# EAGLE design Drehzahlanzeige_RevA (EAGLE 7.6.0)

## Sheet 1 of 2
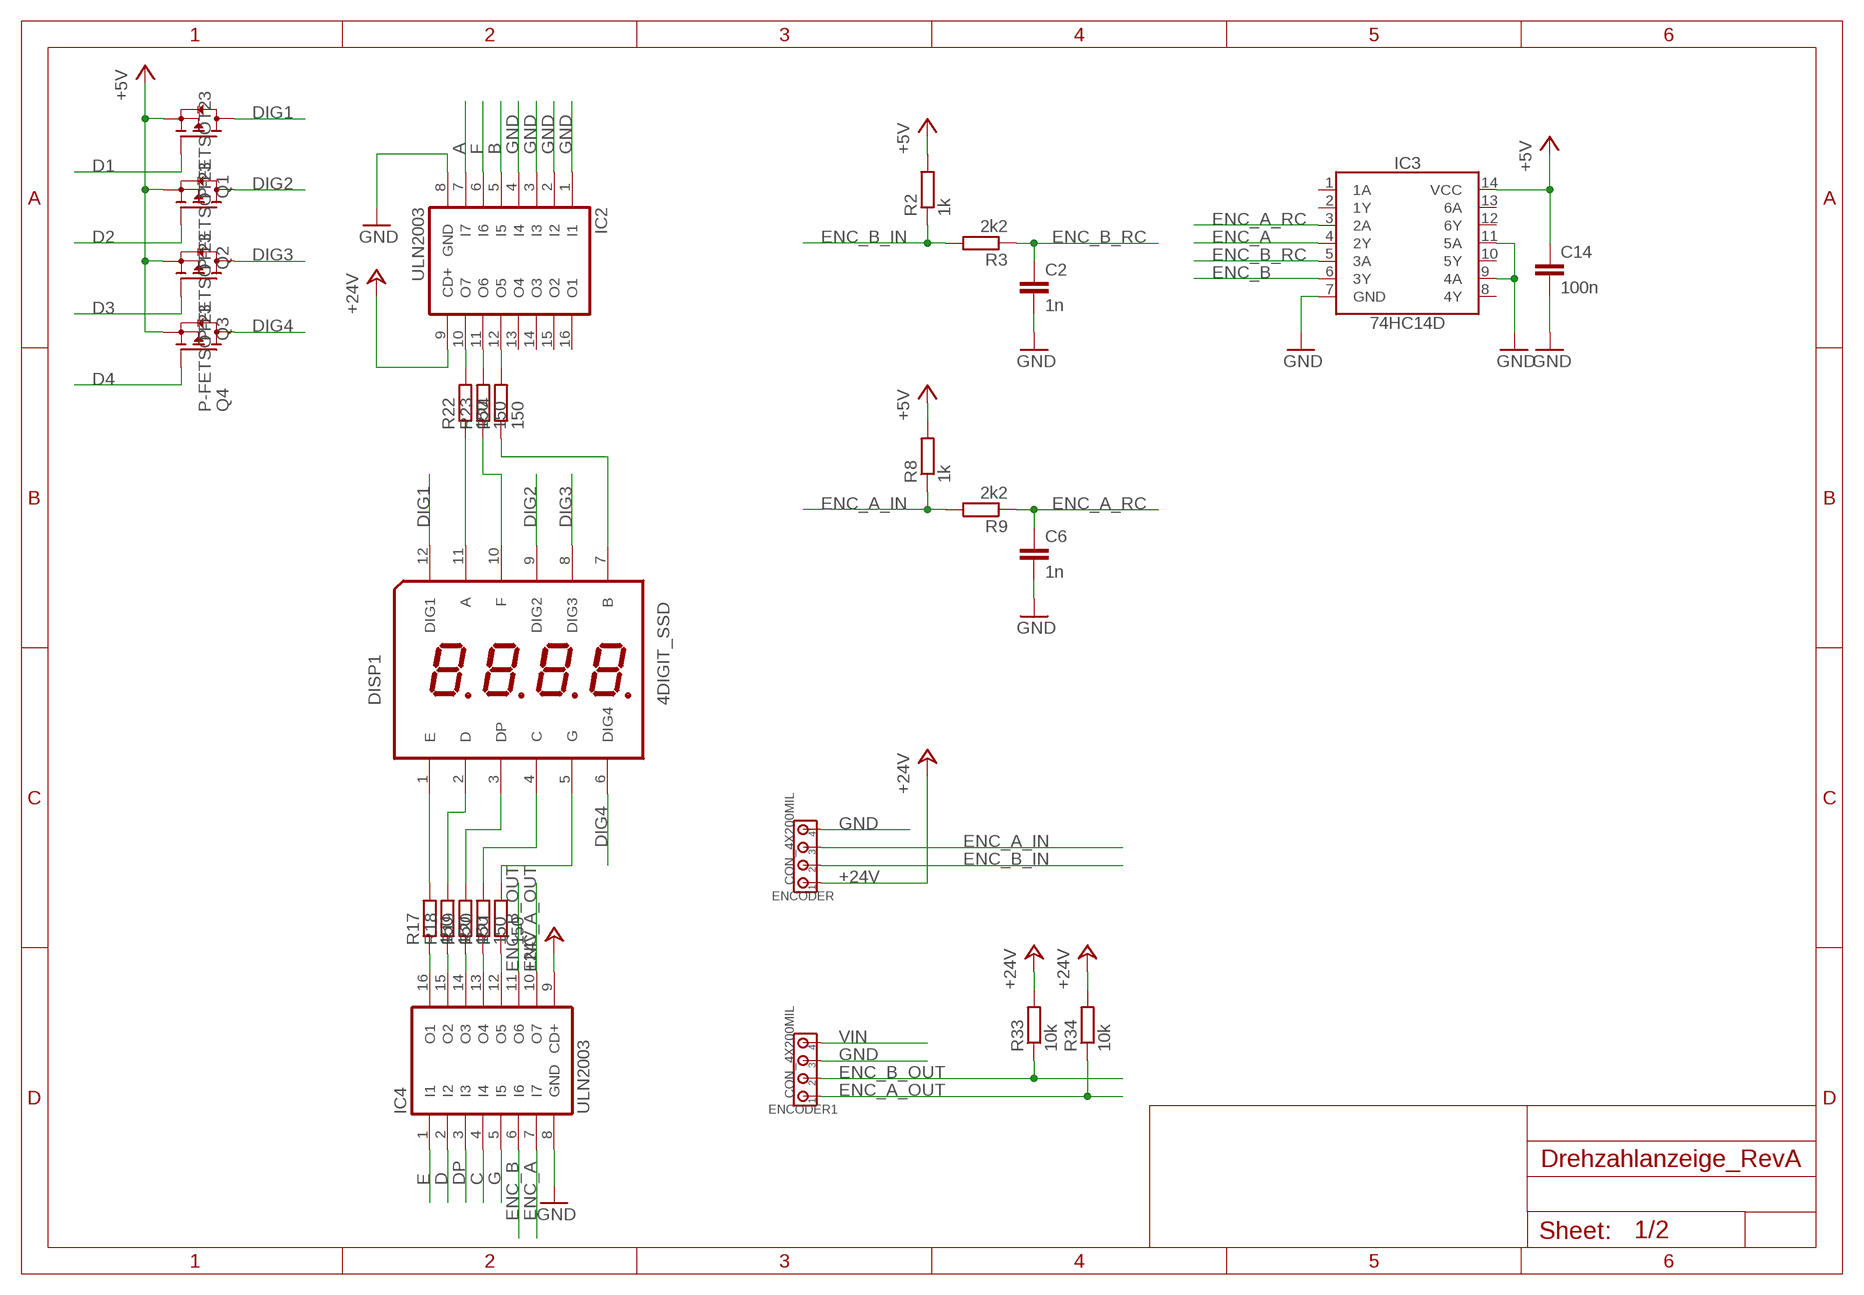
[diagram p0: schematic, sheet 1]

### Parts
C2  1n  CC0805  [C0805]
C6  1n  CC0805  [C0805]
C14  100n  CC0805  [C0805]
DISP1  4DIGIT_SSD  [4DIGIT_SSD]
ENCODER  CON_4X200MIL  [200MIL_4X]
ENCODER1  CON_4X200MIL  [200MIL_4X]
IC2  ULN2003  [SO16]
IC3  74HC14D  [SO14]
IC4  ULN2003  [SO16]
Q1  P-FETSOT23  [SOT23]
Q2  P-FETSOT23  [SOT23]
Q3  P-FETSOT23  [SOT23]
Q4  P-FETSOT23  [SOT23]
R2  1k  RESISTORR0805  [R0805]
R3  2k2  RESISTORR0805  [R0805]
R8  1k  RESISTORR0805  [R0805]
R9  2k2  RESISTORR0805  [R0805]
R17  150  RESISTORR0805  [R0805]
R18  150  RESISTORR0805  [R0805]
R19  150  RESISTORR0805  [R0805]
R20  150  RESISTORR0805  [R0805]
R21  150  RESISTORR0805  [R0805]
R22  150  RESISTORR0805  [R0805]
R23  150  RESISTORR0805  [R0805]
R24  150  RESISTORR0805  [R0805]
R33  10k  RESISTORR0805  [R0805]
R34  10k  RESISTORR0805  [R0805]

### Nets
+5V [+5v]: C14.1 IC3.14(VCC) Q1.2(S) Q2.2(S) Q3.2(S) Q4.2(S) R2.2 R8.2 ; also sheet 2
+24V [+5v]: ENCODER.1 IC2.9(CD+) IC4.9(CD+) R33.2 R34.2 ; also sheet 2
A: IC2.7(I7) ; also sheet 2
B: IC2.5(I5) ; also sheet 2
C: IC4.4(I4) ; also sheet 2
D: IC4.2(I2) ; also sheet 2
D1: Q1.1(G) ; also sheet 2
D2: Q2.1(G) ; also sheet 2
D3: Q3.1(G) ; also sheet 2
D4: Q4.1(G) ; also sheet 2
DIG1: DISP1.12(DIG1) Q1.3(D)
DIG2: DISP1.9(DIG2) Q2.3(D)
DIG3: DISP1.8(DIG3) Q3.3(D)
DIG4: DISP1.6(DIG4) Q4.3(D)
DP: IC4.3(I3) ; also sheet 2
E: IC4.1(I1) ; also sheet 2
ENC_A: IC3.4(2Y) IC4.7(I7) ; also sheet 2
ENC_A_IN: ENCODER.3 R8.1 R9.2
ENC_A_OUT: ENCODER1.1 IC4.10(O7) R34.1
ENC_A_RC: C6.1 IC3.3(2A) R9.1
ENC_B: IC3.6(3Y) IC4.6(I6) ; also sheet 2
ENC_B_IN: ENCODER.2 R2.1 R3.2
ENC_B_OUT: ENCODER1.2 IC4.11(O6) R33.1
ENC_B_RC: C2.1 IC3.5(3A) R3.1
F: IC2.6(I6) ; also sheet 2
G: IC4.5(I5) ; also sheet 2
GND: C2.2 C6.2 C14.2 ENCODER1.3 ENCODER.4 IC2.1(I1) IC2.2(I2) IC2.3(I3) IC2.4(I4) IC2.8(GND) IC3.7(GND) IC3.9(4A) IC3.11(5A) IC4.8(GND) ; also sheet 2
N$5: DISP1.1(E) R17.2
N$6: DISP1.2(D) R18.2
N$10: DISP1.3(DP) R19.2
N$11: DISP1.4(C) R20.2
N$12: DISP1.5(G) R21.2
N$13: DISP1.11(A) R22.1
N$14: DISP1.10(F) R23.1
N$15: DISP1.7(B) R24.1
N$16: IC4.16(O1) R17.1
N$17: IC4.15(O2) R18.1
N$18: IC4.14(O3) R19.1
N$19: IC4.13(O4) R20.1
N$20: IC4.12(O5) R21.1
N$21: IC2.10(O7) R22.2
N$22: IC2.11(O6) R23.2
N$23: IC2.12(O5) R24.2
VIN: ENCODER1.4 ; also sheet 2
Unconnected: IC2.13(O4) IC2.14(O3) IC2.15(O2) IC2.16(O1) IC3.1(1A) IC3.2(1Y) IC3.8(4Y) IC3.10(5Y) IC3.12(6Y) IC3.13(6A)

## Sheet 2 of 2
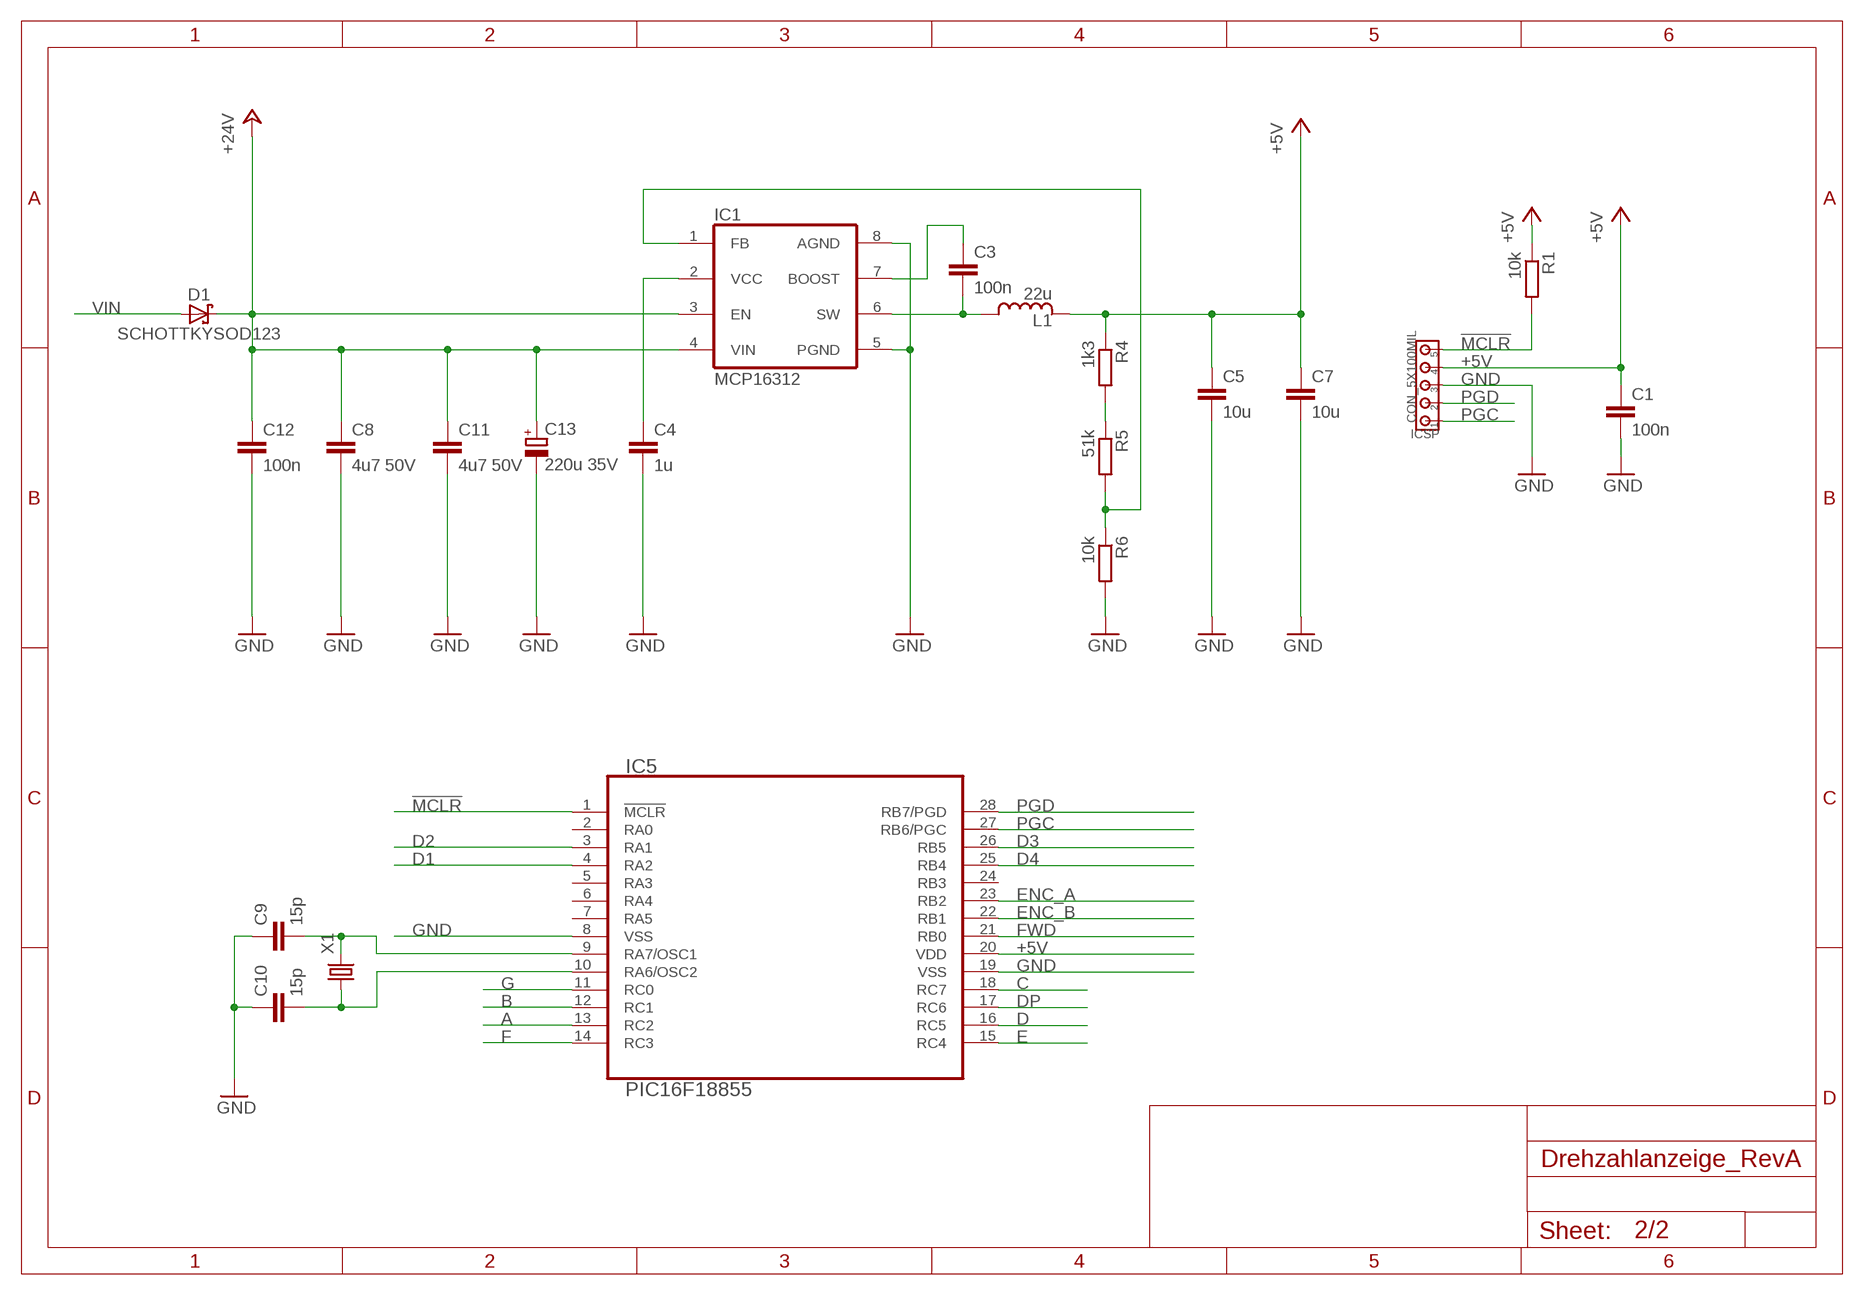
[diagram p1: schematic, sheet 2]

### Parts
C1  100n  CC0805  [C0805]
C3  100n  CC0805  [C0805]
C4  1u  CC0805  [C0805]
C5  10u  CC0805  [C0805]
C7  10u  CC0805  [C0805]
C8  4u7 50V  CC1206  [C1206]
C9  15p  CC0805  [C0805]
C10  15p  CC0805  [C0805]
C11  4u7 50V  CC1206  [C1206]
C12  100n  CC0805  [C0805]
C13  220u 35V  C_POLARIZED8MM  [8MM]
D1  SCHOTTKYSOD123  [SOD123]
IC1  MCP16312  MCP16311  [MSOP8]
IC5  PIC16F18855  [SO28W]
ICSP  CON_5X100MIL  [100MIL_5X]
L1  22u  INDUCTORSRN5040  [SRN5040]
R1  10k  RESISTORR0805  [R0805]
R4  1k3  RESISTORR0805  [R0805]
R5  51k  RESISTORR0805  [R0805]
R6  10k  RESISTORR0805  [R0805]
X1  CRYSTAL5X3.2MM  [5X3.2MM]

### Nets
!MCLR!: IC5.1(!MCLR!) ICSP.5 R1.2
+5V [+5v]: C1.1 C5.1 C7.1 IC5.20(VDD) ICSP.4 L1.2 R1.1 R4.1 ; also sheet 1
+24V [+5v]: C8.1 C11.1 C12.1 C13.+ D1.C IC1.3(EN) IC1.4(VIN) ; also sheet 1
A: IC5.13(RC2) ; also sheet 1
B: IC5.12(RC1) ; also sheet 1
BOOST: C3.1 IC1.7(BOOST)
C: IC5.18(RC7) ; also sheet 1
D: IC5.16(RC5) ; also sheet 1
D1: IC5.4(RA2) ; also sheet 1
D2: IC5.3(RA1) ; also sheet 1
D3: IC5.26(RB5) ; also sheet 1
D4: IC5.25(RB4) ; also sheet 1
DP: IC5.17(RC6) ; also sheet 1
E: IC5.15(RC4) ; also sheet 1
ENC_A: IC5.23(RB2) ; also sheet 1
ENC_B: IC5.22(RB1) ; also sheet 1
F: IC5.14(RC3) ; also sheet 1
FWD: IC5.21(RB0)
G: IC5.11(RC0) ; also sheet 1
GND: C1.2 C4.2 C5.2 C7.2 C8.2 C9.1 C10.1 C11.2 C12.2 C13.- IC1.5(PGND) IC1.8(AGND) IC5.8(VSS) IC5.19(VSS) ICSP.3 R6.2 ; also sheet 1
N$3: IC1.1(FB) R5.2 R6.1
N$4: R4.2 R5.1
N$8: C4.1 IC1.2(VCC)
N$32: C10.2 IC5.10(RA6/OSC2) X1.1
N$33: C9.2 IC5.9(RA7/OSC1) X1.2
PGC: IC5.27(RB6/PGC) ICSP.1
PGD: IC5.28(RB7/PGD) ICSP.2
SWITCH: C3.2 IC1.6(SW) L1.1
VIN: D1.A ; also sheet 1
Unconnected: IC5.2(RA0) IC5.5(RA3) IC5.7(RA5) IC5.24(RB3)

## Power pins joined to a net without a drawn wire
RA4: IC5.6(RA4)

## Library data of the parts
C1-C12 C14 = 00Capacitor:C: Capacitor
C13 = 00Capacitor:C_POLARIZED
D1 = 00Diode:SCHOTTKY
DISP1 = 00Display:4DIGIT_SSD: 4 digit 7-segment display
ENCODER ENCODER1 = 00Connector:CON_4X: 4-pin header
IC1 = 00VoltageRegulator:MCP16311
IC2 IC4 = 00Transistor:ULN2003: Seven Darlington array
IC3 = 00Logic:74HC14: Hex Inverter Schmitt Trigger
IC5 = 00PIC:PIC16F18855
ICSP = 00Connector:CON_5X: 5-pin header
L1 = 00Inductor:INDUCTOR
Q1-Q4 = 00Mosfet:P-FET
R1-R6 R8 R9 R17-R24 R33 R34 = 00Resistor:RESISTOR: RESISTOR, European symbol
X1 = 00Crystal:CRYSTAL: Crystal

## Net classes
1 mains: width 0.813 mm, drill 0.6 mm, clearance 0.813 mm to class 0, clearance 0.813 mm
2 relay: width 0.813 mm, drill 0.6 mm, clearance 0.61 mm to class 0, clearance 0.61 mm to class 1
3 12v: width 0.61 mm, drill 0.6 mm, clearance 0.406 mm to class 0, clearance 0.406 mm to class 1, clearance 0.406 mm to class 2, clearance 0.406 mm
4 analog: width 0.406 mm, drill 0.6 mm, clearance 0.406 mm to class 0, clearance 0.406 mm to class 1, clearance 0.406 mm to class 2, clearance 0.406 mm to class 3, clearance 0.406 mm
5 +5v: width 0.61 mm, drill 0.6 mm, clearance 0.254 mm to class 0, clearance 0.254 mm to class 1, clearance 0.254 mm to class 2, clearance 0.254 mm to class 3, clearance 0.254 mm to class 4, clearance 0.254 mm

## Board
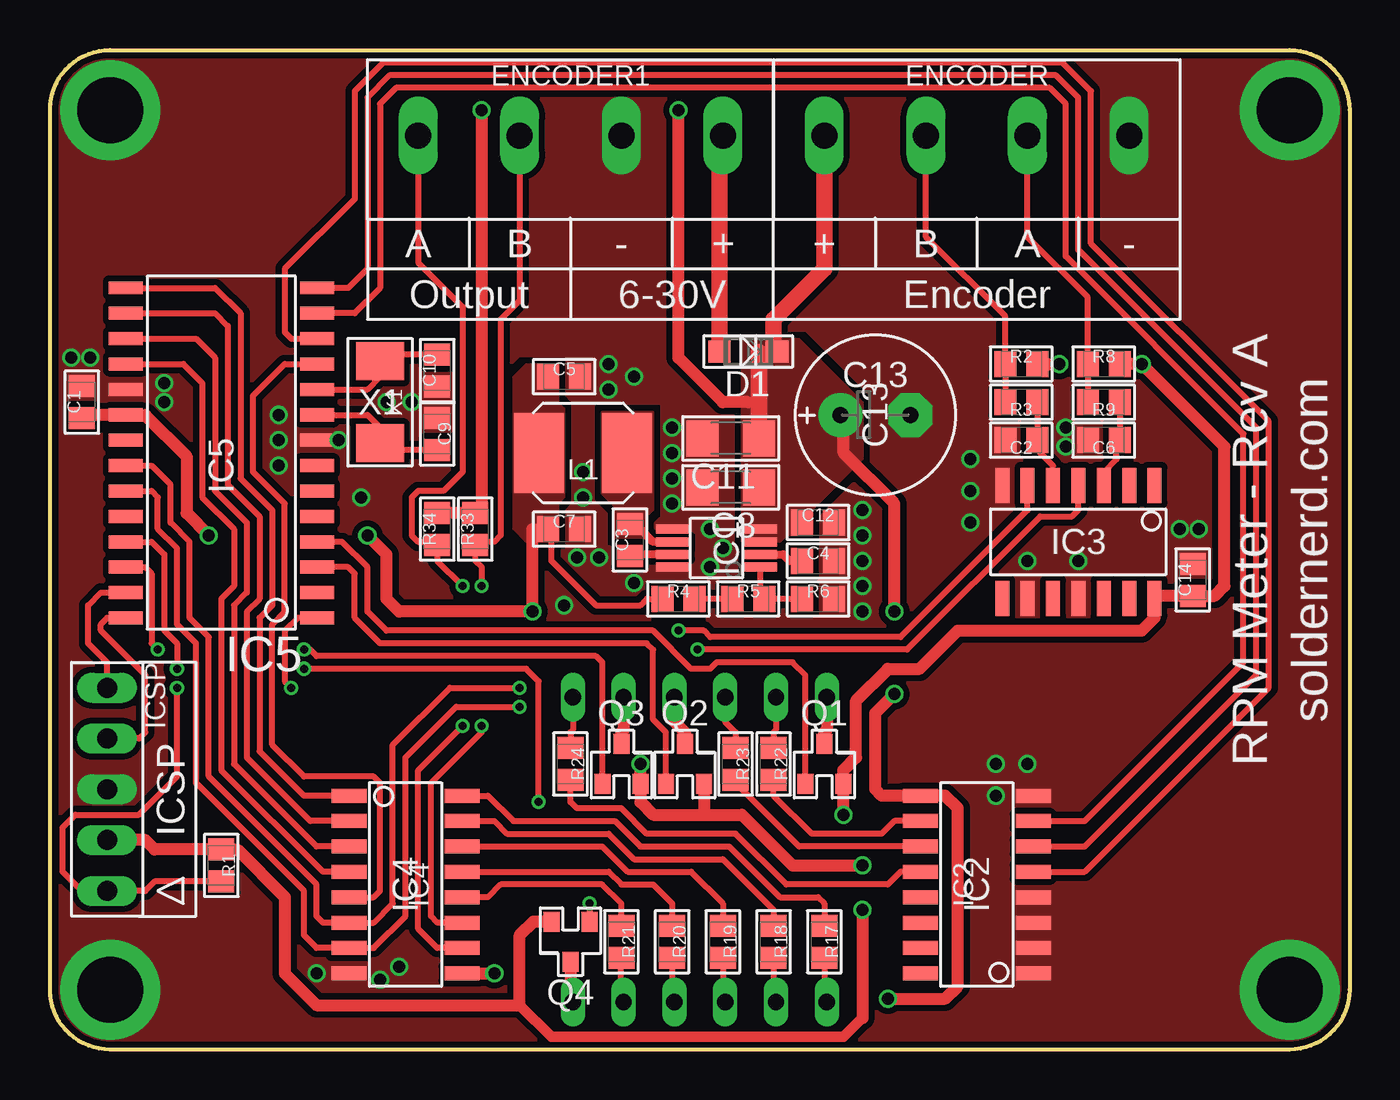
[diagram p2: board, top side]
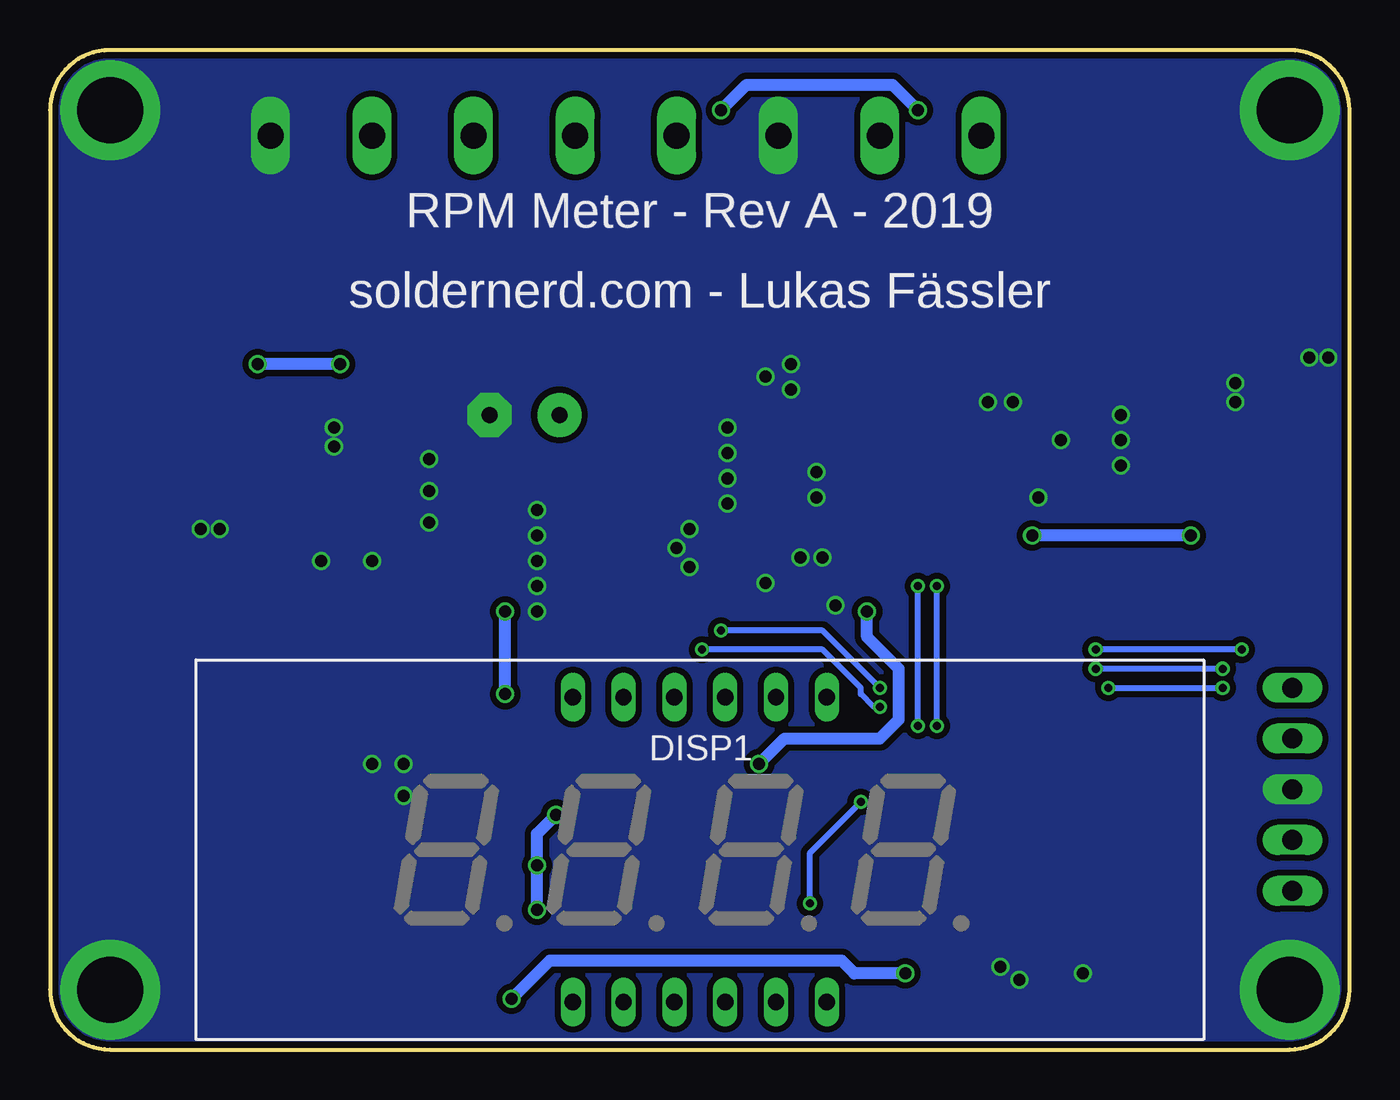
[diagram p3: board, bottom side, seen from below]

Size 65 x 50 mm. Coordinates in mm from the lower left corner, seen from the top.
Outline: 0,3 0,47 arc-90 3,50 62,50 arc-90 65,47 65,3 arc-90 62,0 3,0 arc-90 0,3
Copper layers (1*16): Top 0.035mm / dielectric 1.5mm / Bottom 0.035mm
Design rules "dirt_cheap_dirty_boards.6mil": minimum track width 6mil, minimum drill 12mil, track to track 6mil, track to pad 6mil, pad to pad 6mil, via to via 6mil, smd to smd 0mil, copper to edge 10mil, drill to drill 10mil, minimum pad ring 8mil, minimum via ring 6mil, stop-mask expansion 2mil, vias tented up to drill 25mil, thermal gap 10mil

### Footprints (pad centres in the part's own frame; a part is rotated, then mirrored left to right if it is on the bottom)
C0805 = smd 1.1 x 1.3: 1 -0.8,0; 2 0.8,0
C1206 = smd 1.6 x 1.8: 1 -1.4,0; 2 1.4,0
8MM = drill 0.8 pad 2.2: + -1.75,0 | drill 0.8 pad 2.2 octagon: - 1.75,0
SOD123 = smd 1.1 x 1.1: A 1.45,0; C -1.45,0
4DIGIT_SSD = drill 0.813 long: 1 -6.35,-7.62; 2 -3.81,-7.62; 3 -1.27,-7.62; 4 1.27,-7.62; 5 3.81,-7.62; 6 6.35,-7.62; 7 6.35,7.62; 8 3.81,7.62; 9 1.27,7.62; 10 -1.27,7.62; 11 -3.81,7.62; 12 -6.35,7.62
200MIL_4X = drill 1.3 long: 1 -7.62,0; 2 -2.54,0; 3 2.54,0; 4 7.62,0
MSOP8 = smd 1.65 x 0.45: 1 -2.2,0.953; 2 -2.2,0.318; 3 -2.2,-0.318; 4 -2.2,-0.953; 5 2.2,-0.953; 6 2.2,-0.318; 7 2.2,0.318; 8 2.2,0.953
SO16 = smd 0.7 x 1.75: 1 -4.445,-2.825; 2 -3.175,-2.825; 3 -1.905,-2.825; 4 -0.635,-2.825; 5 0.635,-2.825; 6 1.905,-2.825; 7 3.175,-2.825; 8 4.445,-2.825; 9 4.445,2.825; 10 3.175,2.825; 11 1.905,2.825; 12 0.635,2.825; 13 -0.635,2.825; 14 -1.905,2.825; 15 -3.175,2.825; 16 -4.445,2.825
SO14 = smd 0.7 x 1.75: 1 -3.81,-2.825; 2 -2.54,-2.825; 3 -1.27,-2.825; 4 0,-2.825; 5 1.27,-2.825; 6 2.54,-2.825; 7 3.81,-2.825; 8 3.81,2.825; 9 2.54,2.825; 10 1.27,2.825; 11 0,2.825; 12 -1.27,2.825; 13 -2.54,2.825; 14 -3.81,2.825
SO28W = smd 0.65 x 1.7: 1 -7.62,-4.78; 2 -6.35,-4.78; 3 -5.08,-4.78; 4 -3.81,-4.78; 5 -2.54,-4.78; 6 -1.27,-4.78; 7 0,-4.78; 8 1.27,-4.78; 9 2.54,-4.78; 10 3.81,-4.78; 11 5.08,-4.78; 12 6.35,-4.78; 13 7.62,-4.78; 14 8.89,-4.78; 15 8.89,4.78; 16 7.62,4.78; 17 6.35,4.78; 18 5.08,4.78; 19 3.81,4.78; 20 2.54,4.78; 21 1.27,4.78; 22 0,4.78; 23 -1.27,4.78; 24 -2.54,4.78; 25 -3.81,4.78; 26 -5.08,4.78; 27 -6.35,4.78; 28 -7.62,4.78
100MIL_5X = drill 1 long: 1 -5.08,0; 2 -2.54,0; 3 0,0; 4 2.54,0; 5 5.08,0
SRN5040 = smd 2.5 x 4: 1 -2.2,0; 2 2.2,0
SOT23 = smd 0.8 x 1: 1 -0.95,-1; 2 0.95,-1; 3 0,1
R0805 = smd 1.1 x 1.3: 1 -0.8,0; 2 0.8,0
5X3.2MM = smd 1.9 x 2.4: 1 -2.05,0; 2 2.05,0

### Placement (x,y rotation side)
C1  1.59,32.38 90 top
C2  48.58,30.48 180 top
C3  29,25.5 90 top
C4  38.42,24.45 0 top
C5  25.72,33.66 0 top
C6  52.7,30.48 180 top
C7  25.72,26.04 0 top
C8  34.05,28.11 180 top
C9  19.37,30.8 270 top
C10  19.37,33.97 90 top
C11  34.05,30.57 180 top
C12  38.42,26.35 0 top
C13  41.27,31.75 0 top
C14  57.15,23.5 90 top
D1  34.92,34.92 180 top
DISP1  32.5,10 0 bottom
ENCODER  46.35,45.72 0 top
ENCODER1  26.04,45.72 0 top
IC1  33.34,25.08 180 top
IC2  46.35,8.26 90 top
IC3  51.44,25.4 180 top
IC4  17.78,8.26 270 top
IC5  8.57,29.21 90 top
ICSP  2.86,13.02 270 top
L1  26.67,29.84 180 top
Q1  38.73,14.29 0 top
Q2  31.75,14.29 0 top
Q3  28.57,14.29 0 top
Q4  26.04,5.4 180 top
R1  8.57,9.21 270 top
R2  48.58,34.29 0 top
R3  48.58,32.38 180 top
R4  31.43,22.54 0 top
R5  34.92,22.54 0 top
R6  38.42,22.54 0 top
R8  52.7,34.29 0 top
R9  52.7,32.38 180 top
R17  38.73,5.4 270 top
R18  36.2,5.4 270 top
R19  33.66,5.4 270 top
R20  31.11,5.4 270 top
R21  28.57,5.4 270 top
R22  36.2,14.29 270 top
R23  34.29,14.29 270 top
R24  26.04,14.29 270 top
R33  21.27,26.04 90 top
R34  19.37,26.04 90 top
X1  16.51,32.38 270 top

### Tracks (layer width: path | path; a pad name or v marks a point on that pad's centre or on a via)
!MCLR!  (via drill 0.4)
  Top 0.305: v6.35,18.1 6.35,13.65 4.45,11.75 1.27,11.75 0.64,11.11 0.64,8.89 1.59,7.94 ICSP.5 4.76,7.94 5.23,8.41 R1.2 | IC5.1 12.38,21.59 11.75,20.95 11.75,18.41 v12.06,18.1
  Bottom 0.305: v12.06,18.1 v6.35,18.1
+5V  (via drill 0.6)
  Top 0.305: C7.1 25.08,25.87 25.08,24.45 27.3,22.23 29.53,22.23 29.84,22.54 R4.1
  Top 0.533: 23.5,2.22 25.08,0.64 39.69,0.64 40.64,1.59
  Top 0.61: Q2.2 32.7,11.75 | 32.7,11.75 30.16,11.75 29.53,12.38 29.52,12.38 Q3.2 v29.53,14.29 | 32.7,11.75 34.61,11.75 37.15,9.21 v40.64,9.21 | v39.69,11.75 Q1.2 39.69,13.97 40.32,14.61 40.32,17.46 41.91,19.05 43.5,19.05 45.4,20.95 54.61,20.95 55.24,21.59 IC3.14 55.37,22.7 C14.1 58.26,22.7 58.74,23.18 58.74,30.16 v54.61,34.29 R8.2 | R2.2 v50.48,34.29 | v40.64,6.99 40.64,1.59 | v7.94,25.72 6.83,26.83 6.83,29.69 4.76,31.75 IC5.20 1.75,31.75 C1.1 | C7.1 24.13,26.04 v24.13,21.91 17.46,21.91 16.83,22.54 16.83,24.77 v15.88,25.72 | ICSP.4 4.76,10.48 5.23,10.01 R1.1 9.36,10.01 11.75,7.62 11.75,3.81 13.34,2.22 23.5,2.22 23.5,5.71 24.18,6.4 Q4.2
  Top 0.813: Q2.2
  Bottom 0.61: v40.64,6.99 v40.64,9.21 40.64,10.79 v39.69,11.75 | v50.48,34.29 v54.61,34.29 | v29.53,14.29 28.26,15.56 23.5,15.56 22.54,16.51 22.54,19.05 24.13,20.64 v24.13,21.91 | v7.94,25.72 v15.88,25.72
  pour Top (isolate 0.305, no thermals): 25.4,34.29 25.4,32.38 25.72,32.07 25.72,27.62 25.4,27.3 25.4,25.4 23.81,25.4 23.18,26.04 23.18,33.66 23.81,34.29
+24V  (via drill 0.6)
  Top 0.61: 34.92,32.38 33.66,32.38 31.43,34.61 v31.43,46.99 | v21.59,46.99 21.59,27.15 R33.2 R34.2 | IC4.9 v22.23,3.81 | v41.91,2.54 44.77,2.54 45.4,3.17 45.4,12.06 44.77,12.7 IC2.9 41.59,12.7 41.27,13.02 41.27,16.83 v42.23,17.78 | v42.23,21.91 42.23,27.3 39.69,29.84 39.69,31.59 C13.+
  Top 0.813: D1.C 36.2,34.92 36.2,36.51 38.73,39.05 ENCODER.1 | 35.45,34.9 C11.1
  Bottom 0.61: v31.43,46.99 30.16,48.26 22.86,48.26 v21.59,46.99 | v42.23,17.78 v42.23,21.91 | v22.23,3.81 24.77,3.81 25.4,4.45 40.01,4.45 v41.91,2.54
  pour Top (isolate 0.305, no thermals): 38.1,25.72 36.83,25.72 36.51,25.4 34.61,25.4 34.61,35.56 37.47,35.56 40.64,32.38 40.64,29.53 38.1,26.99
A
  Top 0.305: IC2.7 51.75,11.43 59.69,19.37 59.69,30.8 50.8,39.69 50.8,47.31 50.01,48.1 17.3,48.1 16.51,47.31 16.51,38.1 15.24,36.83 IC5.13
B
  Top 0.305: IC2.5 51.75,8.89 60.96,18.1 60.96,31.43 52.07,40.32 52.07,47.94 50.64,49.37 16.67,49.37 15.24,47.94 15.24,42.55 11.75,39.05 11.75,35.88 12.06,35.56 IC5.12
BOOST
  Top 0.406: IC1.7 29.07,24.77 C3.1
C
  Top 0.305: IC5.18 6.67,34.29 7.62,33.34 7.62,27.62 9.21,26.04 9.21,23.18 8.57,22.54 8.57,13.97 13.65,8.89 IC4.4
D
  Top 0.305: IC5.16 8.26,36.83 8.89,36.2 8.89,28.26 10.48,26.67 10.48,22.54 9.84,21.91 9.84,14.61 13.02,11.43 IC4.2
D1
  Top 0.305: Q1.1 37.78,18.73 37.15,19.37 33.34,19.37 33.02,19.05 32.07,19.05 30.16,20.95 16.83,20.95 15.88,21.91 15.88,24.13 14.61,25.4 IC5.4
D2
  Top 0.305: Q2.1 30.8,15.87 30.16,16.51 30.16,20 29.84,20.32 16.51,20.32 15.24,21.59 15.24,23.81 14.92,24.13 IC5.3
D3  (via drill 0.4)
  Top 0.305: IC5.26 4.76,24.13 5.08,23.81 5.08,20.32 v5.4,20 | Q3.1 27.62,19.36 27.3,19.68 13.34,19.68 13.02,20 v12.7,20
  Bottom 0.305: v5.4,20 v12.7,20
D4  (via drill 0.4)
  Top 0.305: v24.45,12.38 24.45,18.41 23.81,19.05 v12.7,19.05 | IC5.25 5.08,25.4 5.71,24.77 5.71,20.95 6.35,20.32 v6.35,19.05 | v26.99,7.3 Q4.1
  Bottom 0.305: v26.99,7.3 26.99,9.84 v24.45,12.38 | v6.35,19.05 v12.7,19.05
DIG1
  Top 0.61: DISP1.12 38.85,15.99 38.73,15.88 Q1.3
DIG2
  Top 0.61: DISP1.9 31.23,16.39 31.75,15.88 Q2.3
DIG3
  Top 0.406: Q3.3 28.54,15.29
  Top 0.61: DISP1.8 28.69,15.99 28.57,15.88 Q3.3
DIG4
  Top 0.61: Q4.3 26.04,2.5 DISP1.6
DP
  Top 0.305: IC5.17 7.3,35.56 8.26,34.61 8.26,27.94 9.84,26.35 9.84,22.86 9.21,22.23 9.21,14.29 13.34,10.16 IC4.3
E
  Top 0.305: IC5.15 8.26,38.1 9.53,36.83 9.53,28.57 11.11,26.99 11.11,22.23 10.48,21.59 10.48,14.92 12.7,12.7 IC4.1
ENC_A  (via drill 0.4)
  Top 0.305: IC5.23 5.08,27.94 5.4,27.62 5.4,26.04 6.35,25.08 6.35,21.27 7.3,20.32 7.3,13.34 12.7,7.94 12.7,5.71 13.34,5.08 IC4.7 16.19,5.08 17.78,6.67 17.78,14.61 20.32,17.14 v23.5,17.14 | v32.38,20 42.86,20 49.53,26.67 51.12,26.67 51.44,26.99 IC3.4
  Bottom 0.305: v23.5,17.14 23.81,17.14 24.45,17.78 24.45,18.1 26.35,20 v32.38,20
ENC_A_IN
  Top 0.305: R9.2 R8.1 51.91,37.63 48.9,40.64 ENCODER.3
ENC_A_OUT  (via drill 0.4)
  Top 0.305: IC4.10 19.37,5.08 18.41,6.03 18.41,13.97 v20.64,16.19 | ENCODER1.1 18.41,39.37 20.64,37.15 20.64,28.89 19.68,27.94 18.41,27.94 18.1,27.62 18.1,25.72 18.41,25.4 19.2,25.4 R34.1 19.37,24.45 v20.64,23.18
  Bottom 0.305: v20.64,16.19 v20.64,23.18
ENC_A_RC
  Top 0.305: R9.1 C6.1 53.34,30.32 53.34,29.53 52.7,28.89 IC3.3
ENC_B  (via drill 0.4)
  Top 0.305: IC5.22 5.08,29.21 6.03,28.26 6.03,26.35 6.99,25.4 6.99,21.59 7.94,20.64 7.94,13.65 13.34,8.26 13.34,6.67 13.65,6.35 IC4.6 16.19,6.35 17.14,7.3 17.14,15.24 20,18.1 v23.5,18.1 | v31.43,20.95 32.7,20.95 33.02,20.64 42.55,20.64 48.9,26.99 IC3.6
  Bottom 0.305: v23.5,18.1 26.35,20.95 v31.43,20.95
ENC_B_IN
  Top 0.305: R3.2 R2.1 47.78,36.68 43.81,40.64 ENCODER.2
ENC_B_OUT  (via drill 0.4)
  Top 0.305: IC4.11 19.37,6.35 19.05,6.67 19.05,13.34 21.59,15.88 v21.59,16.19 | ENCODER1.2 23.5,37.47 22.54,36.51 22.54,25.72 22.23,25.4 21.44,25.4 R33.1 21.27,24.45 21.59,24.13 v21.59,23.18
  Bottom 0.305: v21.59,16.19 v21.59,23.18
ENC_B_RC
  Top 0.305: R3.1 C2.1 49.53,30.33 49.53,29.84 50.16,29.21 IC3.5
F
  Top 0.305: IC2.6 51.75,10.16 60.33,18.73 60.33,31.11 51.44,40.01 51.44,47.62 50.32,48.74 16.99,48.74 15.88,47.62 15.88,39.05 14.92,38.1 IC5.14
G
  Top 0.305: IC4.5 16.19,7.62 16.51,7.94 16.51,13.34 16.19,13.65 12.7,13.65 11.11,15.24 11.11,21.27 11.75,21.91 11.75,27.3 10.16,28.89 10.16,32.7 11.75,34.29 IC5.11
GND  (via drill 0.6, 3.3 pad 5)
  other vias: 16.83,32.38 18.1,32.38 2.02,34.62 1.06,34.62 51.44,24.45 48.9,14.29 47.31,12.7 47.31,14.29 13.34,3.81 3,47 62,47 62,3 3,3 33.02,24.13 33.66,25.08 33.02,26.04 31.11,27.3 31.11,28.57 31.11,29.84 31.11,31.11 40.64,26.99 40.64,25.72 40.64,24.45 40.64,23.18 40.64,21.91 17.46,4.13 16.51,3.49 5.71,33.34 5.71,32.38 46.04,29.53 46.04,27.94 46.04,26.35 50.8,31.11 50.8,30.16 11.43,31.75 11.43,30.48 11.43,29.21 14.45,30.48 15.56,27.62 25.72,22.23 26.35,24.61 26.67,27.62 26.67,28.89 29.21,33.66 27.94,34.29 27.94,33.02 57.47,26.04 56.52,26.04 48.9,24.45 27.46,24.61 29.21,23.34
  pour Bottom (isolate 0.305, rank 2, no thermals): 0,47 0,3 arc90 3,0 62,0 arc90 65,3 65,47 arc90 62,50 3,50 arc90
  pour Top (isolate 0.305, rank 2, no thermals): 0,47 0,3 arc90 3,0 62,0 arc90 65,3 65,47 arc90 62,50 3,50 arc90
N$3
  Top 0.305: R6.1 R5.2 35.54,22.54 | 35.54,22.41 35.54,22.54 | 35.54,22.54 IC1.1
N$4
  Top 0.305: R5.1 R4.2
N$5
  Top 0.305: R17.2 38.73,2.5 DISP1.1
N$6
  Top 0.305: R18.2 36.2,2.5 DISP1.2
N$8
  Top 0.406: IC1.2 36.67,24.77 36.99,24.45 C4.1
N$10
  Top 0.305: R19.2 33.66,2.5 DISP1.3
N$11
  Top 0.305: R20.2 31.11,2.5 DISP1.4
N$12
  Top 0.305: 28.54,4.56 28.54,2.54 DISP1.5
  Top 0.406: 28.54,4.56 R21.2
N$13
  Top 0.305: DISP1.11 36.31,15.99 36.2,15.88 R22.1
N$14
  Top 0.305: DISP1.10 33.77,16.39 34.29,15.88 R23.1
N$15
  Top 0.305: DISP1.7 26.15,15.99 26.04,15.88 R24.1
  Top 0.406: R24.1 26,15.09
N$16
  Top 0.305: IC4.16 21.91,12.7 23.18,11.43 28.26,11.43 29.53,10.16 33.97,10.16 36.51,7.62 38.42,7.62 38.73,7.3 R17.1
N$17
  Top 0.305: IC4.15 22.23,11.43 22.86,10.79 27.94,10.79 29.21,9.53 33.66,9.53 36.2,6.99 R18.1
N$18
  Top 0.305: IC4.14 27.62,10.16 28.89,8.89 32.07,8.89 33.66,7.3 R19.1
N$19
  Top 0.305: IC4.13 27.94,8.89 28.57,8.26 30.16,8.26 31.11,7.3 R20.1
N$20
  Top 0.305: R21.1 28.57,7.3 27.62,8.26 22.54,8.26 21.91,7.62 IC4.12
N$21
  Top 0.305: IC2.10 42.23,11.43 41.59,10.79 38.1,10.79 36.2,12.7 R22.2
N$22
  Top 0.305: IC2.11 37.47,10.16 34.29,13.34 R23.2
N$23
  Top 0.305: IC2.12 42.55,8.89 41.91,8.26 36.83,8.26 34.29,10.79 29.84,10.79 28.57,12.06 26.35,12.06 26.04,12.38 R24.2
N$32
  Top 0.305: IC5.10 15.88,33.02 16.51,33.66 X1.1 16.85,34.77 C10.2
N$33
  Top 0.305: IC5.9 15.88,31.75 16.51,31.11 X1.2 16.85,30 C9.2
PGC
  Top 0.305: ICSP.1 2.86,19.37 1.91,20.32 1.91,22.23 2.54,22.86 IC5.27
PGD
  Top 0.305: ICSP.2 4.45,15.56 4.76,15.88 4.76,18.73 2.54,20.95 2.54,21.27 2.86,21.59 IC5.28
SWITCH
  Top 0.406: IC1.6 30.16,25.4 29.53,26.04
  pour Top (isolate 0.305, no thermals): 31.91,25.24 28.26,25.24 28.26,27.15 27.62,27.78 27.62,31.91 30.16,31.91 30.16,26.99 29.84,26.67 29.84,25.72 30,25.56 31.91,25.56
VIN
  Top 0.813: D1.A 33.48,45.54 ENCODER1.4

### Text on the board
tPlace: A | B | - | + | + | B | A | - | Output | 6-30V | Encoder | RPM Meter - Rev A | soldernerd.com | ICSP
bPlace: RPM Meter - Rev A - 2019 | soldernerd.com - Lukas Fässler